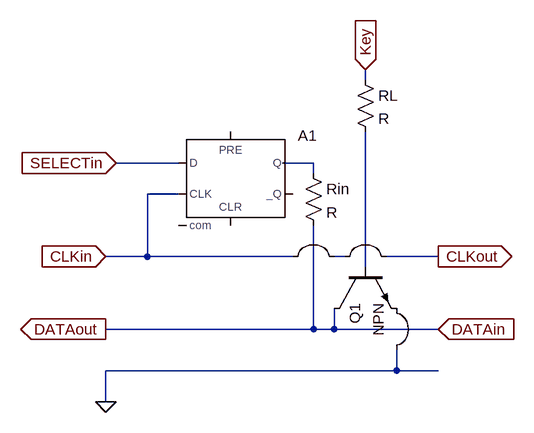
[diagram p0: schematic Individual Circuit Diagram.asc]
Individual Circuit Diagram.asc, the LTspice schematic file:
Version 4
SHEET 1 880 680
WIRE 320 -16 320 -32
WIRE 32 112 -64 112
WIRE 240 112 192 112
WIRE 240 128 240 112
WIRE 32 160 -16 160
WIRE -16 256 -16 160
WIRE -16 256 -80 256
WIRE 208 256 -16 256
WIRE 288 256 272 256
WIRE 432 256 352 256
WIRE 320 272 320 64
WIRE 240 368 240 208
WIRE 240 368 -80 368
WIRE 272 368 272 336
WIRE 272 368 240 368
WIRE 432 368 272 368
WIRE 368 432 368 400
WIRE 368 432 -80 432
WIRE 432 432 368 432
WIRE -80 480 -80 432
FLAG -80 256 CLKin
IOPIN -80 256 In
FLAG -64 112 SELECTin
IOPIN -64 112 In
FLAG -80 368 DATAout
IOPIN -80 368 Out
FLAG 320 -32 Key
IOPIN 320 -32 In
FLAG 432 256 CLKout
IOPIN 432 256 Out
FLAG 432 368 DATAin
IOPIN 432 368 In
FLAG -80 480 0
SYMBOL Digital\\dflop 112 64 R0
SYMATTR InstName A1
SYMBOL npn 272 272 M90
SYMATTR InstName Q1
SYMBOL res 304 -32 R0
SYMATTR InstName RL
SYMBOL res 224 112 R0
SYMATTR InstName Rin
SYMBOL Misc\\jumper 240 192 R0
WINDOW 0 0 40 Invisible 2
SYMATTR InstName X1
SYMBOL Misc\\jumper 320 192 R0
WINDOW 0 0 40 Invisible 2
SYMATTR InstName X2
SYMBOL Misc\\jumper 432 368 R90
WINDOW 0 0 40 Invisible 2
SYMATTR InstName X3

The netlist it stands for:
* Individual Circuit Diagram.asc
A1 SELECTin 0 CLKout 0 0 0 N001 0 DFLOP
Q1 DATAin N002 0 0 NPN
RL Key N002 R
Rin N001 DATAin R
.model NPN NPN
.model PNP PNP
.lib standard.bjt
.backanno
.end